# EAGLE design 14a12 (EAGLE 5.10)
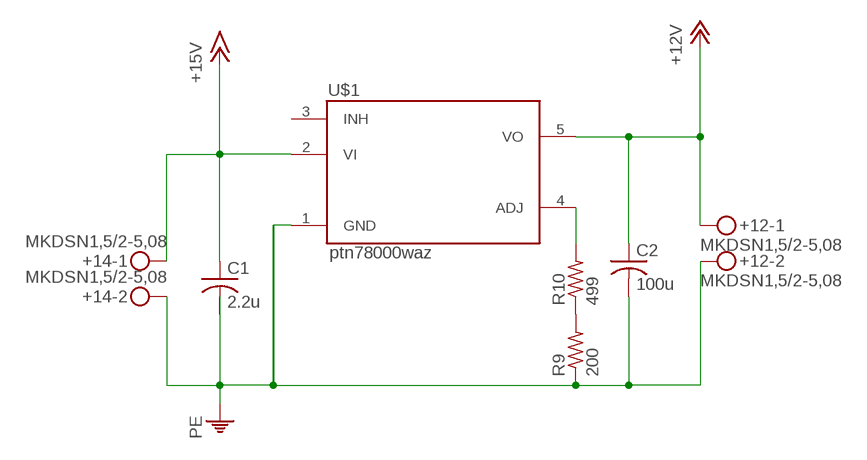
[diagram p0: schematic, sheet 1]

## Parts
+12  MKDSN1,5/2-5,08  [MKDSN1,5/2-5,08]
+14  MKDSN1,5/2-5,08  [MKDSN1,5/2-5,08]
C1  2.2u  C-US050-045X075  [C050-045X075]
C2  100u  C-US050-045X075  [C050-045X075]
R9  200  R-US_M1206  [M1206]
R10  499  R-US_M1206  [M1206]
U$1  PTN78000W  [PTN78000W]

## Nets
+12V: +12.1 C2.1 U$1.5(VO)
+14V: +14.1 C1.1 U$1.2(VI) ; supply symbol labelled +15V
GND: +12.2 +14.2 C1.2 C2.2 R9.1 U$1.1(GND) ; supply symbol labelled PE
N$1: R9.2 R10.1
N$2: R10.2 U$1.4(ADJ)
Unconnected: U$1.3(INH)

## Library data of the parts
+12 +14 = con-phoenix-508:MKDSN1,5/2-5,08: MKDSN 1,5/ 2-5,08 Printklemme Nennstrom: 13,5 A Nennspannung: 250 V Rastermaß: 5,08 mm Polzahl: 2 Anschlussart: Schraubanschluss Montage: Löten Anschlussrichtung Leiter/Platine: 0 ° Artikelnummer: 1729128 Source: http://eshop.phoenixcontact.com .. 1729128.pdf
C1 C2 = rcl:C-US: CAPACITOR, American symbol
R9 R10 = rcl:R-US_: RESISTOR, American symbol
U$1 = PTN78000:PTN78000W

## Board
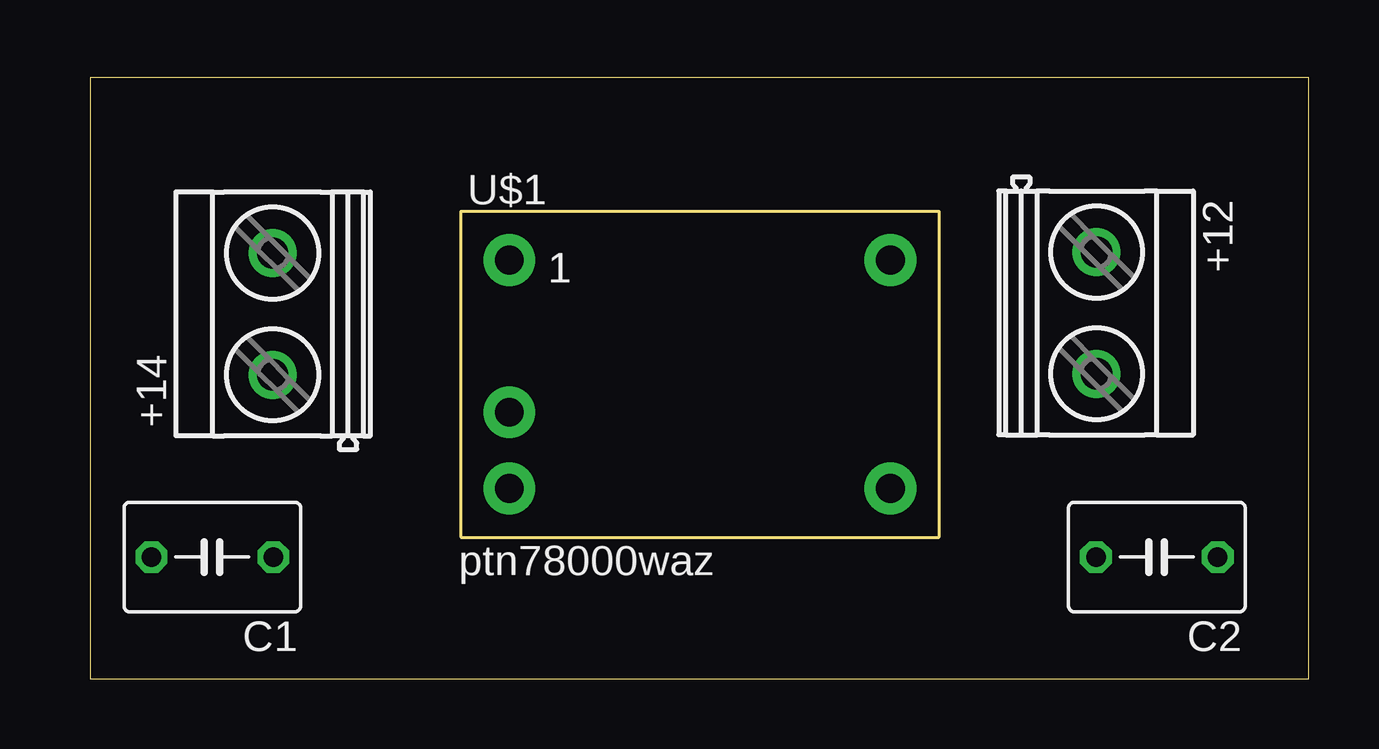
[diagram p1: board, top side]
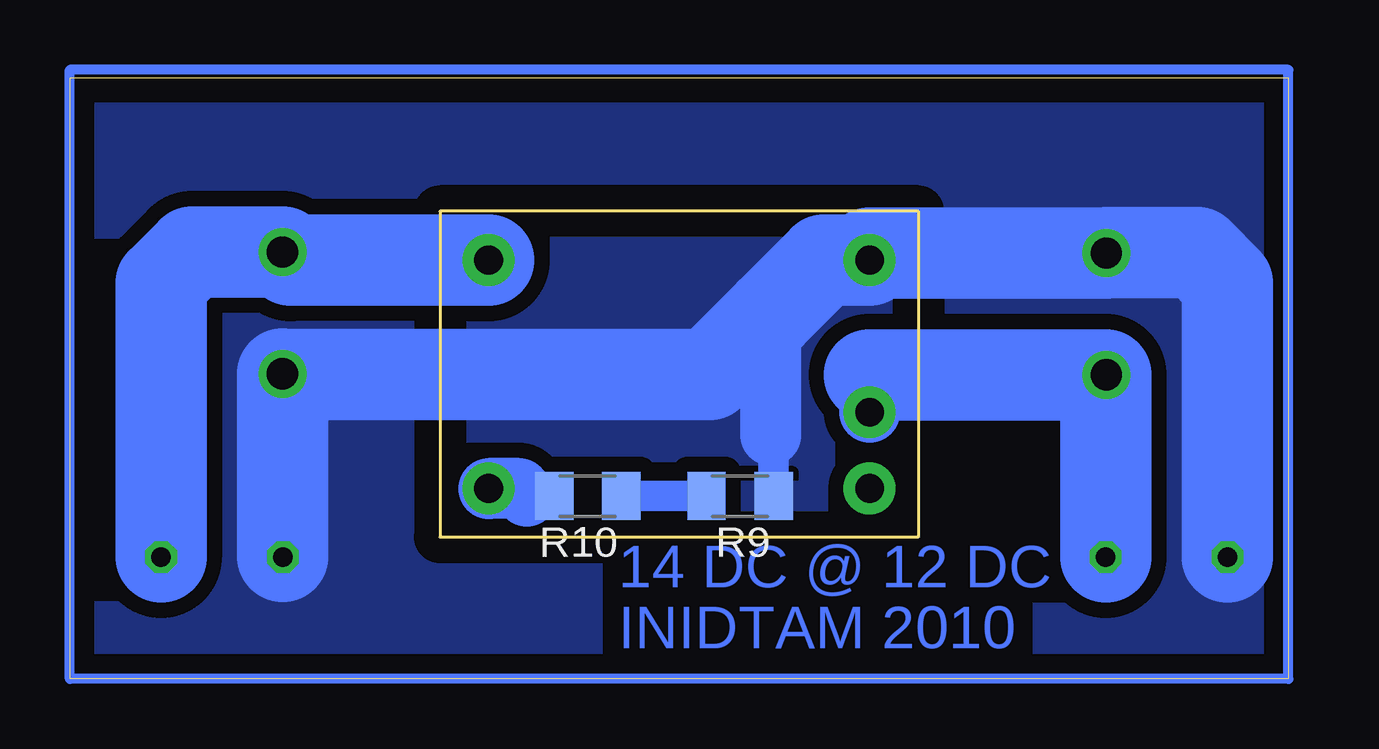
[diagram p2: board, bottom side, seen from below]

Size 50.78 x 25.07 mm. Coordinates in mm from the lower left corner, seen from the top.
Outline: 0,0 50.78,0 50.78,25.07 0,25.07 0,0
Copper layers (1*16): Top 0.035mm / dielectric 1.5mm / Bottom 0.035mm
Design rules "default *": minimum track width 10mil, minimum drill 24mil, track to track 25mil, track to pad 25mil, pad to pad 8mil, via to via 8mil, smd to smd 8mil, copper to edge 40mil, drill to drill 8mil, minimum pad ring 10mil, minimum via ring 8mil, stop-mask expansion 4mil, vias tented up to drill 0mil, thermal gap 10mil

### Footprints (pad centres in the part's own frame; a part is rotated, then mirrored left to right if it is on the bottom)
MKDSN1,5/2-5,08 = drill 1.3 pad 2 round: 1 -2.561,0.025; 2 2.519,0.025
C050-045X075 = drill 0.813 octagon: 1 -2.54,0; 2 2.54,0
M1206 = smd 1.6 x 2: 1 -1.4,0; 2 1.4,0
PTN78000W = drill 1.2 pad 2.16 round: 1 -7.94,4.76; 2 -7.94,-1.58; 3 -7.94,-4.76; 4 7.94,-4.76; 5 7.94,4.76

### Placement (x,y rotation side)
+12  41.91,15.24 270 top
+14  7.62,15.24 90 top
C1  5.08,5.08 180 top
C2  44.45,5.08 180 top
R9  22.86,7.62 180 bottom
R10  29.21,7.62 180 bottom
U$1  25.4,12.7 0 top

### Tracks (layer width: path | path; a pad name or v marks a point on that pad's centre or on a via)
+12V
  Bottom 2.54: 41.59,17.46 +12.1
  Bottom 3.81: U$1.5 41.59,17.46 | +12.1 45.7,17.8 46.99,16.51 C2.1
+14V
  Bottom 2.54: 17.46,12.68 U$1.2 | 7.62,12.68 +14.1
  Bottom 3.81: 17.46,12.68 7.62,12.68 C1.1
GND
  Bottom 1.27: R9.1 21.46,10.03 21.59,10.16
  Bottom 2.54: 17.46,17.76 U$1.1 | 41.94,5.11 C2.2 41.91,12.7 | 7.57,17.78 +14.2 | 21.59,15.24 21.59,10.16
  Bottom 3.81: +14.2 17.46,17.76 | 41.94,5.11 +12.2 | C1.2 2.54,16.51 3.81,17.78 7.57,17.78 | U$1.1 19.37,17.46 21.59,15.24 24.13,12.7 41.91,12.7
  pour Bottom: 0,0 0,25.4 50.8,25.4 50.8,0
N$1
  Bottom 1.27: R9.2 R10.1
N$2
  Bottom 1.27: R10.2 31.75,7.62
  Bottom 2.54: U$1.4 32.07,7.94 31.75,7.62
S$1
  Bottom 0.406: 0,0 0,25.4 50.8,25.4 50.8,0 0,0

### Text on the board
Bottom: 14 DC @ 12 DC | INIDTAM 2010